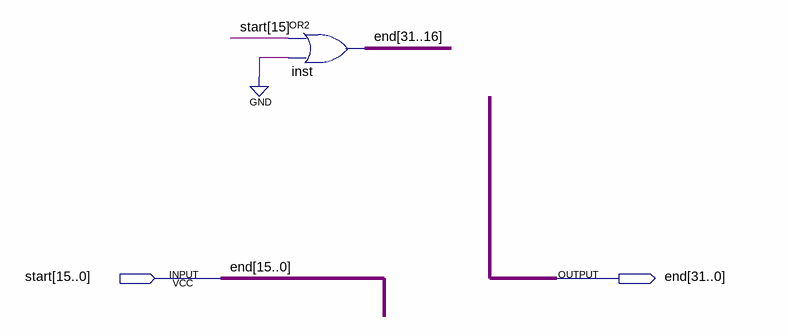
[diagram p0: schematic sheet]
// Quartus schematic sign_extend.bdf as structural Verilog: 1 symbols, 2 pins
module sign_extend (
  input  [15:0] start,
  output [31:0] \end 
);

  assign \end [31:16] = {16{start[15]}} | {16{1'b0}};  // OR2 inst, 16 bits wide

  assign \end [15:0] = start;
endmodule
